# EAGLE schematic Control Board (EAGLE 7.7.0)
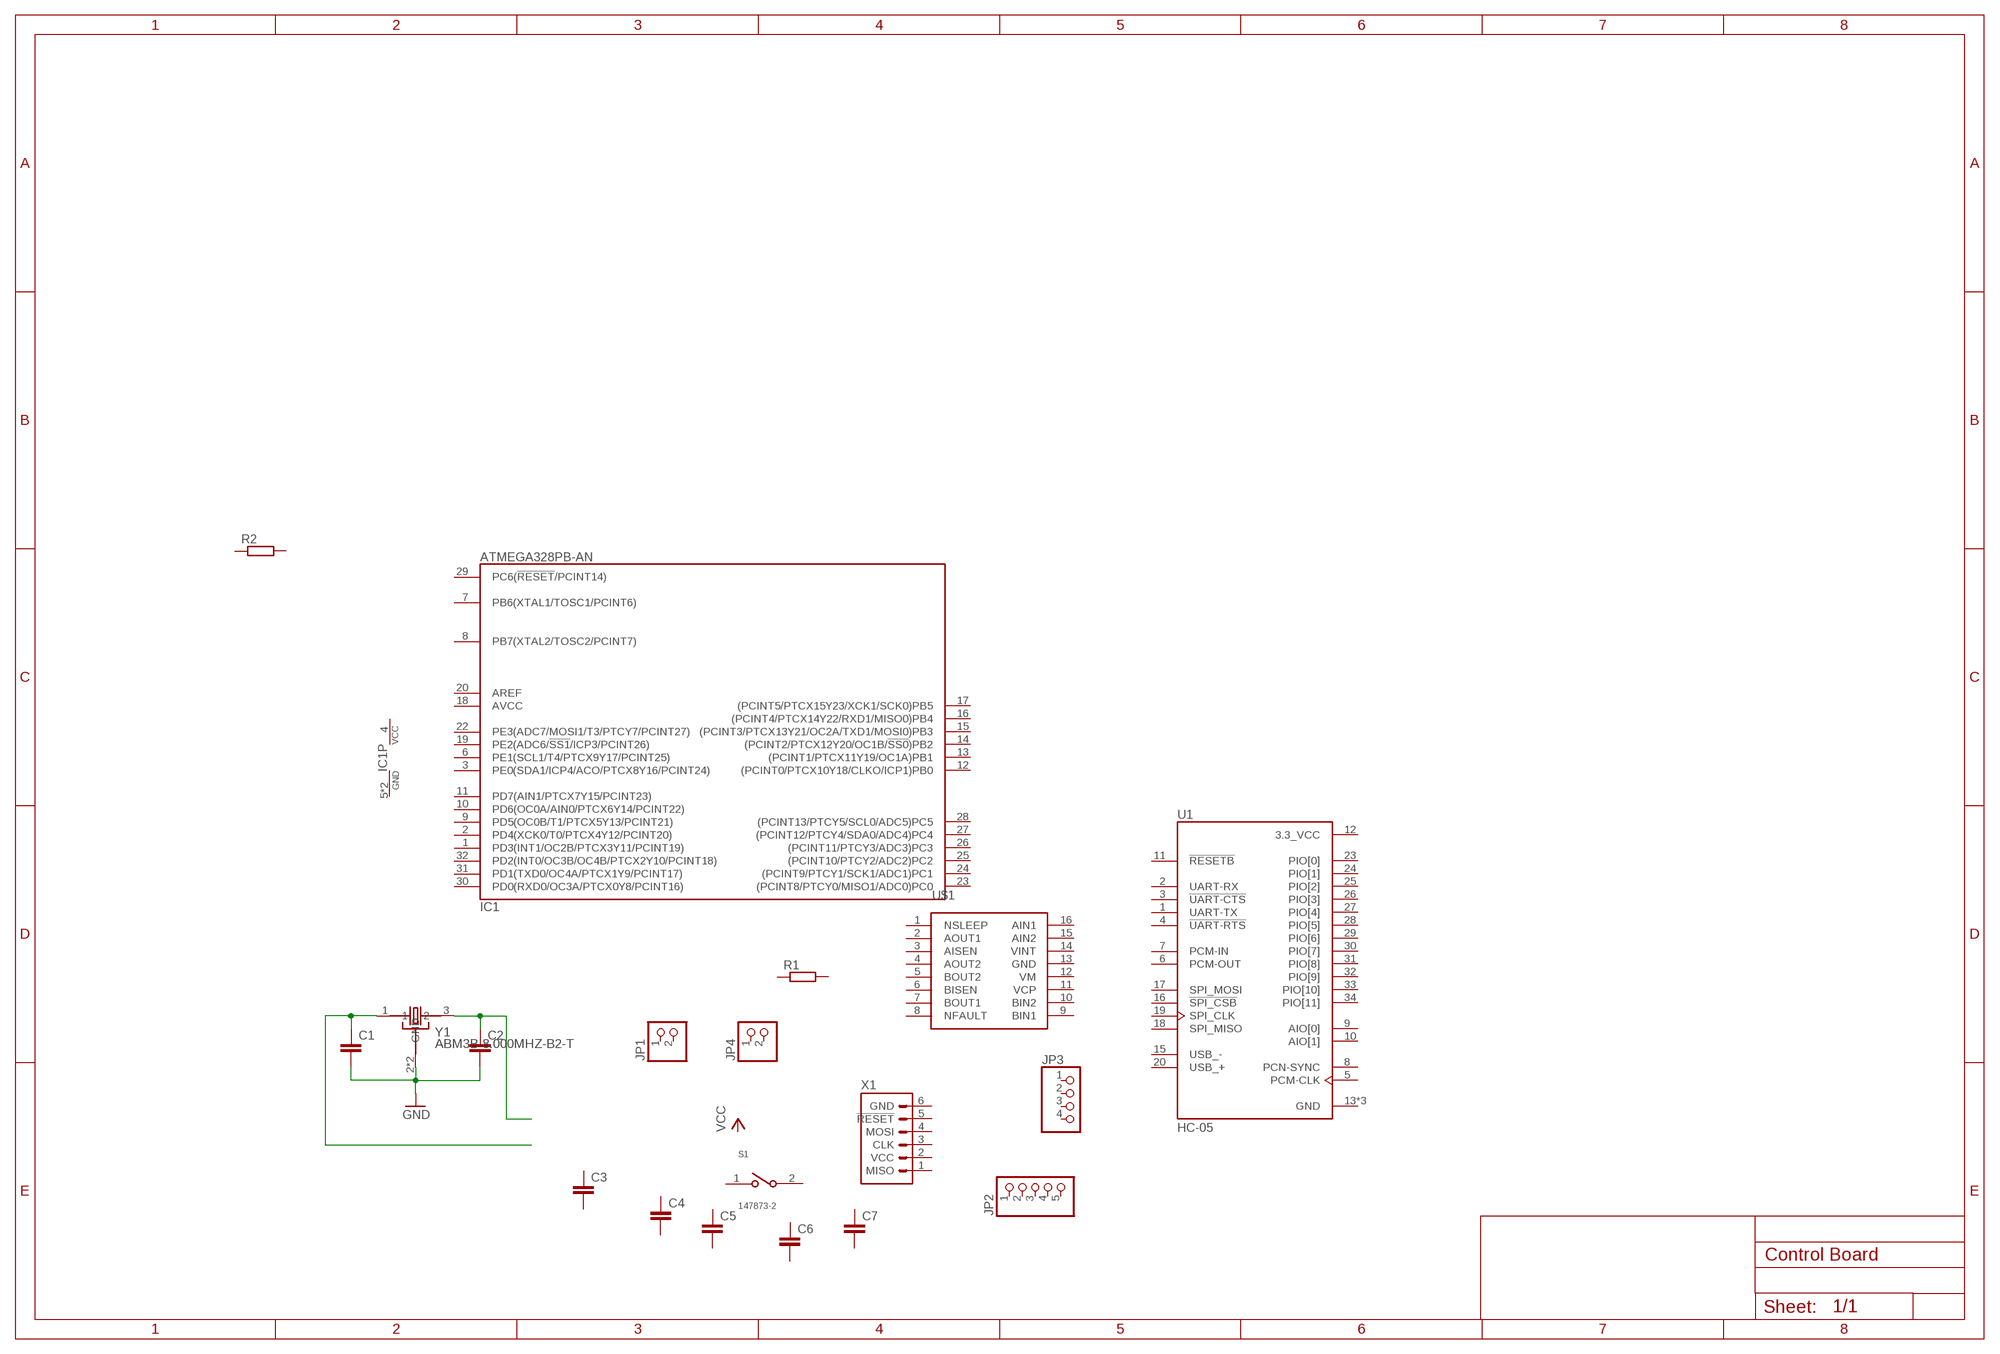
[diagram p0: schematic, sheet 1]

## Parts
C1  C-EUC0805  [C0805]
C2  C-EUC0805  [C0805]
C3  C-EUC0805  [C0805]
C4  C-EUC0805  [C0805]
C5  C-EUC0805  [C0805]
C6  C-EUC0805  [C0805]
C7  C-EUC0805  [C0805]
IC1  ATMEGA328PB-AN  [QFP32_7X7_0.80]
JP1  PINHD-1X2/90  [1X02/90]
JP2  PINHD-1X5/90  [1X05/90]
JP3  PINHD-1X4  [1X04]
JP4  PINHD-1X2/90  [1X02/90]
R1  R-EU_0207/7  [0207/7]
R2  R-EU_VTA55  [VTA55]
S1  147873-2  [SW_147873-2]
U1  HC-05  [XCVR_HC-05]
U$1  DVR8833SUPERFICIAL  [PWP16]
X1  MISO_MOSITHT_100MIL  [PINHEADER_2R03_100MIL]
Y1  ABM3B-8.000MHZ-B2-T  [OSCSC500X320X110-4N]

## Nets
GND: C1.2 C2.2 Y1.2(GND) Y1.4(GND)
N$1: C1.1 Y1.1
N$2: C2.1 Y1.3
Unconnected: C3.1 C3.2 C4.1 C4.2 C5.1 C5.2 C6.1 C6.2 C7.1 C7.2 IC1.1(PD3(INT1/OC2B/PTCX3Y11/PCINT19)) IC1.2(PD4(XCK0/T0/PTCX4Y12/PCINT20)) IC1.3(PE0(SDA1/ICP4/ACO/PTCX8Y16/PCINT24)) IC1.6(PE1(SCL1/T4/PTCX9Y17/PCINT25)) IC1.7(PB6(XTAL1/TOSC1/PCINT6)) IC1.8(PB7(XTAL2/TOSC2/PCINT7)) IC1.9(PD5(OC0B/T1/PTCX5Y13/PCINT21)) IC1.10(PD6(OC0A/AIN0/PTCX6Y14/PCINT22)) IC1.11(PD7(AIN1/PTCX7Y15/PCINT23)) IC1.12((PCINT0/PTCX10Y18/CLKO/ICP1)PB0) IC1.13((PCINT1/PTCX11Y19/OC1A)PB1) IC1.14((PCINT2/PTCX12Y20/OC1B/!SS0!)PB2) IC1.15((PCINT3/PTCX13Y21/OC2A/TXD1/MOSI0)PB3) IC1.16((PCINT4/PTCX14Y22/RXD1/MISO0)PB4) IC1.17((PCINT5/PTCX15Y23/XCK1/SCK0)PB5) IC1.19(PE2(ADC6/!SS1!/ICP3/PCINT26)) IC1.20(AREF) IC1.22(PE3(ADC7/MOSI1/T3/PTCY7/PCINT27)) IC1.23((PCINT8/PTCY0/MISO1/ADC0)PC0) IC1.24((PCINT9/PTCY1/SCK1/ADC1)PC1) IC1.25((PCINT10/PTCY2/ADC2)PC2) IC1.26((PCINT11/PTCY3/ADC3)PC3) IC1.27((PCINT12/PTCY4/SDA0/ADC4)PC4) IC1.28((PCINT13/PTCY5/SCL0/ADC5)PC5) IC1.29(PC6(!RESET!/PCINT14)) IC1.30(PD0(RXD0/OC3A/PTCX0Y8/PCINT16)) IC1.31(PD1(TXD0/OC4A/PTCX1Y9/PCINT17)) IC1.32(PD2(INT0/OC3B/OC4B/PTCX2Y10/PCINT18)) JP1.1 JP1.2 JP2.1 JP2.2 JP2.3 JP2.4 JP2.5 JP3.1 JP3.2 JP3.3 JP3.4 JP4.1 JP4.2 R1.1 R1.2 R2.1 R2.2 S1.1 S1.2 U1.1(UART-TX) U1.2(UART-RX) U1.3(!UART-CTS) U1.4(!UART-RTS) U1.5(PCM-CLK) U1.6(PCM-OUT) U1.7(PCM-IN) U1.8(PCN-SYNC) U1.9(AIO[0]) U1.10(AIO[1]) U1.11(!RESETB) U1.15(USB_-) U1.16(!SPI_CSB) U1.17(SPI_MOSI) U1.18(SPI_MISO) U1.19(SPI_CLK) U1.20(USB_+) U1.23(PIO[0]) U1.24(PIO[1]) U1.25(PIO[2]) U1.26(PIO[3]) U1.27(PIO[4]) U1.28(PIO[5]) U1.29(PIO[6]) U1.30(PIO[7]) U1.31(PIO[8]) U1.32(PIO[9]) U1.33(PIO[10]) U1.34(PIO[11]) U$1.1(NSLEEP) U$1.2(AOUT1) U$1.3(AISEN) U$1.4(AOUT2) U$1.5(BOUT2) U$1.6(BISEN) U$1.7(BOUT1) U$1.8(NFAULT) U$1.9(BIN1) U$1.10(BIN2) U$1.11(VCP) U$1.12(VM) U$1.13(GND) U$1.14(VINT) U$1.15(AIN2) U$1.16(AIN1) X1.1(MISO) X1.2(VCC) X1.3(CLK) X1.4(MOSI) X1.5(!RESET) X1.6(GND)

## Power pins joined to a net without a drawn wire
3.3_VCC: U1.12(3.3_VCC)
AVCC: IC1.18(AVCC)
GND: IC1.5(GND) IC1.21(GND) U1.13(GND) U1.21(GND) U1.22(GND)
VCC: IC1.4(VCC)

## Library data of the parts
C1-C7 = rcl:C-EU: CAPACITOR, European symbol
IC1 = atmel328:ATMEGA328PB: 8-bit AVR Microcontroller 32kbytes flash 2kbytes SRAM 1kbyte EEPROM USART 8-channel 10 bit ADC
JP1 JP4 = pinhead:PINHD-1X2: PIN HEADER
JP2 = pinhead:PINHD-1X5: PIN HEADER
JP3 = pinhead:PINHD-1X4: PIN HEADER
R1 R2 = rcl:R-EU_: RESISTOR, European symbol
S1 = 147873-2:147873-2: SWITCH TACTILE SPST-NO 0.05A 24V Check prices <https://pricing.snapeda.com/parts/147873-2/TE%20Connectivity/view-part?ref=eda>; AVAILABILITY: Good; COMMENT: 147873-2; CONFIGURATION_POLE-THROW: Single Pole - Single Throw; CONTACT_CURRENT_RATING: 50 mA; DESCRIPTION: Switch Tactile OFF (ON) SPST Rectangular Button J-Bend 0.05A 24VDC 1.77N SMD T/R; MF: TE Connectivity; MP: 147873-2; PACKAGE: None; PRICE: None; PURCHASE-URL: https://pricing.snapeda.com/search/part/147873-2/?ref=eda
U1 = HC-05:HC-05: Bluetooth to Serial Port Module; AVAILABILITY: Unavailable; DESCRIPTION: Bluetooth to Serial Port Module; MF: Bel Power solution; MP: HC-05; PACKAGE: SOIC-14; PRICE: None
U$1 = personales:DVR8833
X1 = atmel328:MISO_MOSI: MISO/MOSI Programmer Interface refere to Atmel/Microchip description of pin header style <http://microchipdeveloper.com/atmelice:connecting-atmel-ice-to-a-debugwire-target>; OC_FARNELL: unknown; OC_NEWARK: unknown
Y1 = ABM3B-8.000MHZ-B2-T:ABM3B-8.000MHZ-B2-T: Crystal 8MHz ±20ppm (Tol) ±50ppm (Stability) 18pF FUND 200Ohm 4-Pin CSMD T/R Check prices <https://pricing.snapeda.com/parts/ABM3B-8.000MHZ-B2-T/Abracon/view-part?ref=eda>; AVAILABILITY: Good; DESCRIPTION: 8MHz ±20ppm Crystal 18pF 200 Ohms 4-SMD, No Lead; MF: Abracon; MP: ABM3B-8.000MHZ-B2-T; PACKAGE: SMD-4 Abracon; PRICE: None; PURCHASE-URL: https://pricing.snapeda.com/search/part/ABM3B-8.000MHZ-B2-T/?ref=eda